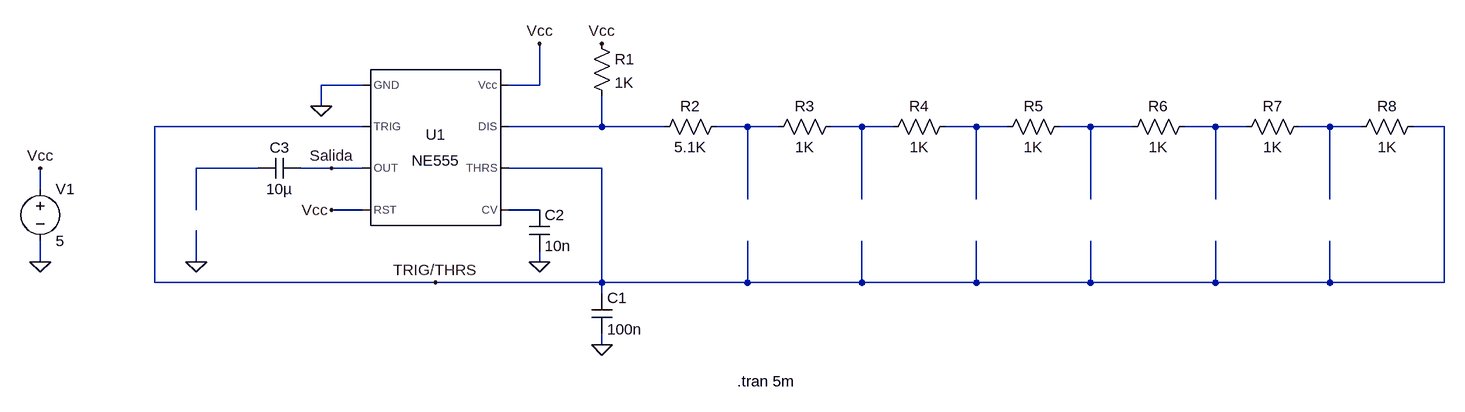
[diagram p0: schematic piano.asc]
piano.asc, the LTspice schematic file:
Version 4
SHEET 1 1748 680
WIRE 80 80 16 80
WIRE 352 80 352 16
WIRE 352 80 304 80
WIRE 16 112 16 80
WIRE 80 144 -240 144
WIRE 448 144 448 96
WIRE 448 144 304 144
WIRE 544 144 448 144
WIRE 672 144 624 144
WIRE 720 144 672 144
WIRE 848 144 800 144
WIRE 896 144 848 144
WIRE 1024 144 976 144
WIRE 1072 144 1024 144
WIRE 1200 144 1152 144
WIRE 1264 144 1200 144
WIRE 1392 144 1344 144
WIRE 1440 144 1392 144
WIRE 1568 144 1520 144
WIRE 1616 144 1568 144
WIRE 1744 144 1696 144
WIRE -80 208 -176 208
WIRE 32 208 -16 208
WIRE 80 208 32 208
WIRE 448 208 304 208
WIRE -416 240 -416 208
WIRE 672 256 672 144
WIRE 848 256 848 144
WIRE 1024 256 1024 144
WIRE 1200 256 1200 144
WIRE 1392 256 1392 144
WIRE 1568 256 1568 144
WIRE -176 272 -176 208
WIRE 80 272 32 272
WIRE 352 272 304 272
WIRE -416 352 -416 320
WIRE -176 352 -176 304
WIRE 352 352 352 336
WIRE -240 384 -240 144
WIRE 192 384 -240 384
WIRE 448 384 448 208
WIRE 448 384 192 384
WIRE 672 384 672 320
WIRE 672 384 448 384
WIRE 848 384 848 320
WIRE 848 384 672 384
WIRE 1024 384 1024 320
WIRE 1024 384 848 384
WIRE 1200 384 1200 320
WIRE 1200 384 1024 384
WIRE 1392 384 1392 320
WIRE 1392 384 1200 384
WIRE 1568 384 1568 320
WIRE 1568 384 1392 384
WIRE 1744 384 1744 144
WIRE 1744 384 1568 384
WIRE 448 400 448 384
WIRE 448 480 448 464
FLAG -416 352 0
FLAG 352 352 0
FLAG -416 208 Vcc
FLAG 352 16 Vcc
FLAG 32 272 Vcc
FLAG 16 112 0
FLAG 448 16 Vcc
FLAG 448 480 0
FLAG 192 384 TRIG/THRS
FLAG -176 352 0
FLAG 32 208 Salida
SYMBOL Misc\\NE555 192 176 R0
SYMATTR InstName U1
SYMBOL voltage -416 224 R0
WINDOW 123 0 0 Left 0
WINDOW 39 0 0 Left 0
SYMATTR InstName V1
SYMATTR Value 5
SYMBOL res 432 0 R0
SYMATTR InstName R1
SYMATTR Value 1K
SYMBOL cap 336 272 R0
SYMATTR InstName C2
SYMATTR Value 10n
SYMBOL cap 432 400 R0
SYMATTR InstName C1
SYMATTR Value 100n
SYMBOL res 640 128 R90
WINDOW 0 0 56 VBottom 2
WINDOW 3 32 56 VTop 2
SYMATTR InstName R2
SYMATTR Value 5.1K
SYMBOL res 816 128 R90
WINDOW 0 0 56 VBottom 2
WINDOW 3 32 56 VTop 2
SYMATTR InstName R3
SYMATTR Value 1K
SYMBOL res 992 128 R90
WINDOW 0 0 56 VBottom 2
WINDOW 3 32 56 VTop 2
SYMATTR InstName R4
SYMATTR Value 1K
SYMBOL res 1168 128 R90
WINDOW 0 0 56 VBottom 2
WINDOW 3 32 56 VTop 2
SYMATTR InstName R5
SYMATTR Value 1K
SYMBOL res 1360 128 R90
WINDOW 0 0 56 VBottom 2
WINDOW 3 32 56 VTop 2
SYMATTR InstName R6
SYMATTR Value 1K
SYMBOL res 1536 128 R90
WINDOW 0 0 56 VBottom 2
WINDOW 3 32 56 VTop 2
SYMATTR InstName R7
SYMATTR Value 1K
SYMBOL cap -16 192 R90
WINDOW 0 0 32 VBottom 2
WINDOW 3 32 32 VTop 2
SYMATTR InstName C3
SYMATTR Value 10µ
SYMBOL res 1712 128 R90
WINDOW 0 0 56 VBottom 2
WINDOW 3 32 56 VTop 2
SYMATTR InstName R8
SYMATTR Value 1K
TEXT 656 536 Left 2 !.tran 5m

The netlist it stands for:
* piano.asc
XU1 0 TRIG/THRS Salida Vcc N009 TRIG/THRS N001 Vcc NE555  ; pins GND TRIG OUT RST CV THRS DIS Vcc
V1 Vcc 0 5
R1 Vcc N001 1K
C2 N009 0 10n
C1 TRIG/THRS 0 100n
R2 N002 N001 5.1K
R3 N003 N002 1K
R4 N004 N003 1K
R5 N005 N004 1K
R6 N006 N005 1K
R7 N007 N006 1K
C3 Salida N008 10µ
R8 TRIG/THRS N007 1K
.tran 5m
.lib NE555.sub
.backanno
.end